# EasyEDA schematic Opto_sensor_Comperator.json
TITLE: opto sensor for aitomatic mode motor exhibit energy exhebition \n based on drop sensor for water drop screen and/or UV cure exhebit; REV: 0.0; Date: 2024-10-13; Sheet: 1/1; Drawn By: AmirB; Company: Your Company
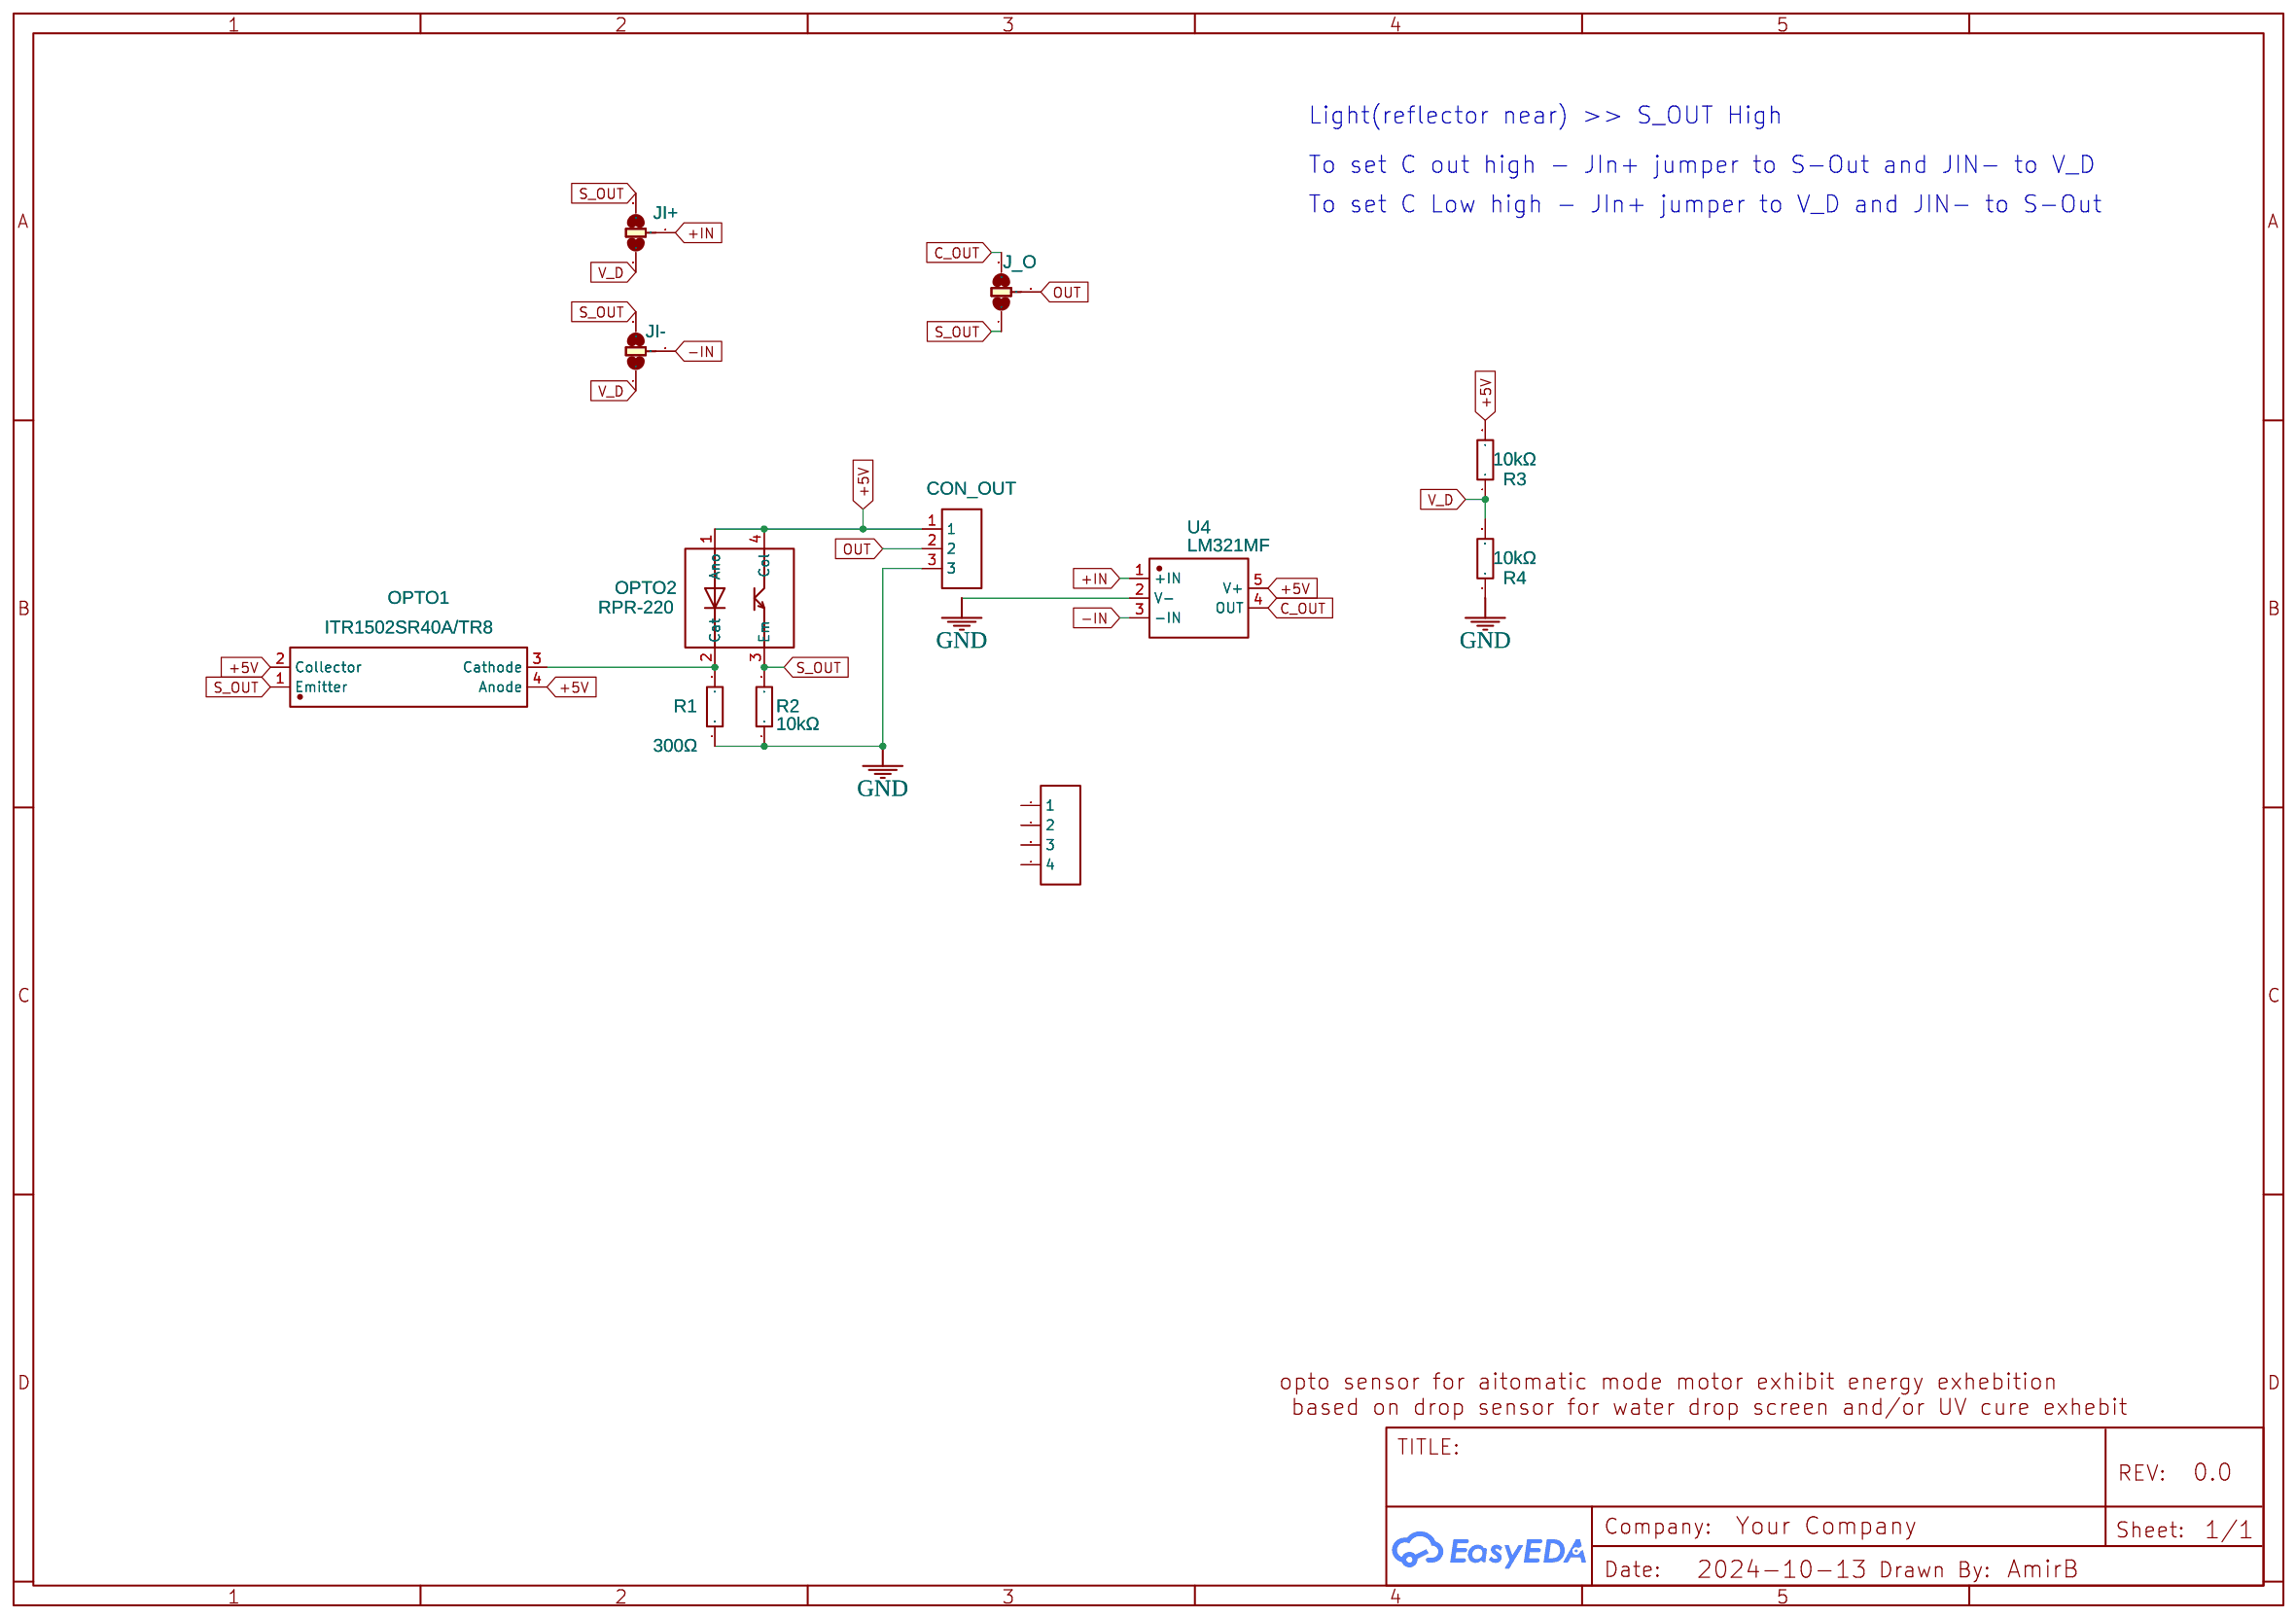
[diagram p0: schematic sheet]

## Parts
CON_OUT  FK2510  [CONN-TH_3P-P2.00_KF2510_3A]
J1  HDR-M-2.54_1x4  [HDR-M-2.54_1X4]
J_O  JUMPER-PAD-3-NOYES_SILK  [PAD-JUMPER-3-NO_YES_SILK]
JI+  JUMPER-PAD-3-NOYES_SILK  [PAD-JUMPER-3-NO_YES_SILK]
JI-  JUMPER-PAD-3-NOYES_SILK  [PAD-JUMPER-3-NO_YES_SILK]
OPTO1  ITR1502SR40A/TR8  [SW-SMD_4P-L4.0-W3.0_ITR1502SR40A-TR8]
OPTO2  RPR-220  [LED-TH_4P_RPR-220]
R1  300Ω  [R0603]
R2  10kΩ  [R0603]
R3  10kΩ  [R0603]
R4  10kΩ  [R0603]
U4  LM321MF  [SOT-23-5_L2.9-W1.6-P0.95-LS2.8-BL]

## Library data of the parts
CON_OUT = kf2510_3A: JLCPCB Part Class: Extended Part; Package Display: No
J1 = HDR-M-2.54_1x4: Supplier Part: C124378; Supplier: LCSC; Contributor: LCEDA_Lib; Package Display: No
J_O JI+ JI- = JUMPER-PAD-3-NOYES_SILK: Contributor: SparkFun; Package Display: No
OPTO1 = ITR1502SR40A/TR8: Contributor: LCSC; Supplier: LCSC; Supplier Part: C183793; Manufacturer: EVERLIGHT(亿光); JLCPCB Part Class: Extended Part; Package Display: No
OPTO2 = RPR-220: Supplier: LCSC; Manufacturer: ROHM(罗姆); Supplier Part: C21062; JLCPCB Part Class: Extended Part; Package Display: No
R1 = 0603WAF3000T5E: Supplier: LCSC; Manufacturer: UNI-ROYAL(厚声); Supplier Part: C23025; JLCPCB Part Class: Basic Part; Package Display: No
R2-R4 = 0603WAF1002T5E: Supplier: LCSC; Manufacturer: UNI-ROYAL(厚声); Supplier Part: C25804; JLCPCB Part Class: Basic Part; Package Display: No
U4 = LM321MF: Contributor: LCSC; Supplier: LCSC; Supplier Part: C668208; Manufacturer: UMW(友台半导体); JLCPCB Part Class: Extended Part; Package Display: No

## Nets
+5V: CON_OUT.1 OPTO1.2(Collector) OPTO1.4(Anode) OPTO2.1(Ano) OPTO2.4(Col) R3.2 U4.5(V+)
GND: CON_OUT.3 R1.1 R2.1 R4.1 U4.2(V-)
+IN: JI+.2 U4.1(+IN)
-IN: JI-.2 U4.3(-IN)
C_OUT: J_O.3 U4.4(OUT)
OUT: CON_OUT.2 J_O.2
S_OUT: J_O.1 JI+.3 JI-.3 OPTO1.1(Emitter) OPTO2.3(Em) R2.2
V_D: JI+.1 JI-.1 R3.1 R4.2
Net-(OPTO1-3): OPTO1.3(Cathode) OPTO2.2(Cat) R1.2

Not connected (* = marked no-connect by the designer): J1 1 2 3 4

## Notes on the sheet
- Light(reflector near) >> S_OUT High
- To set C out high - JIn+ jumper to S-Out and JIN- to V_D
- To set C Low high - JIn+ jumper to V_D and JIN- to S-Out
